# Altium schematic sheet VCM-Power.SchDoc: Power
size A4; SheetNumber: 3; SheetTotal: 3
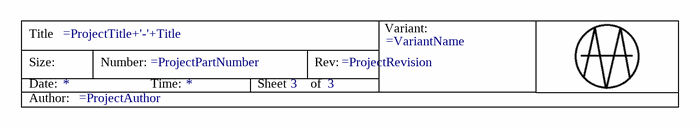
[diagram p0: VCM-Power.SchDoc]

## Parts
?  Total Sheets: 3  (hidden comment: Title Block Logo)  (graphical)

## Notes on the sheet
- Title
- Size:
- Date:
- A4
- Number:
- Time:
- Revision:
- Sheet
- of
- File:
- (in symbol Title Block Logo) Variant:; Title; Size:; Number:; Rev:; Date:; Time:; Sheet; of; Author:

## Library data of the parts
? = Title Block Logo: Sheet Title: =ProjectTitle+'-'+Title; Document Number: =ProjectPartNumber; Revision Number: =ProjectRevision; Organization Address 1: =VariantName; Date: *; Time: *; Document Path and Name: =ProjectAuthor; Sheet Number: 3